# Altium schematic sheet sb-sonata-fpgapwr.SchDoc: <Enter Sheet Title>
size Letter; Organization: NewAE Technology Inc.; Address1: 1083 Queen St., Suite 196; Address2: Halifax; Address3: NS; Address4: Canada B3H 0B2; SheetNumber: 14; SheetTotal: 20; SheetApproved: YES
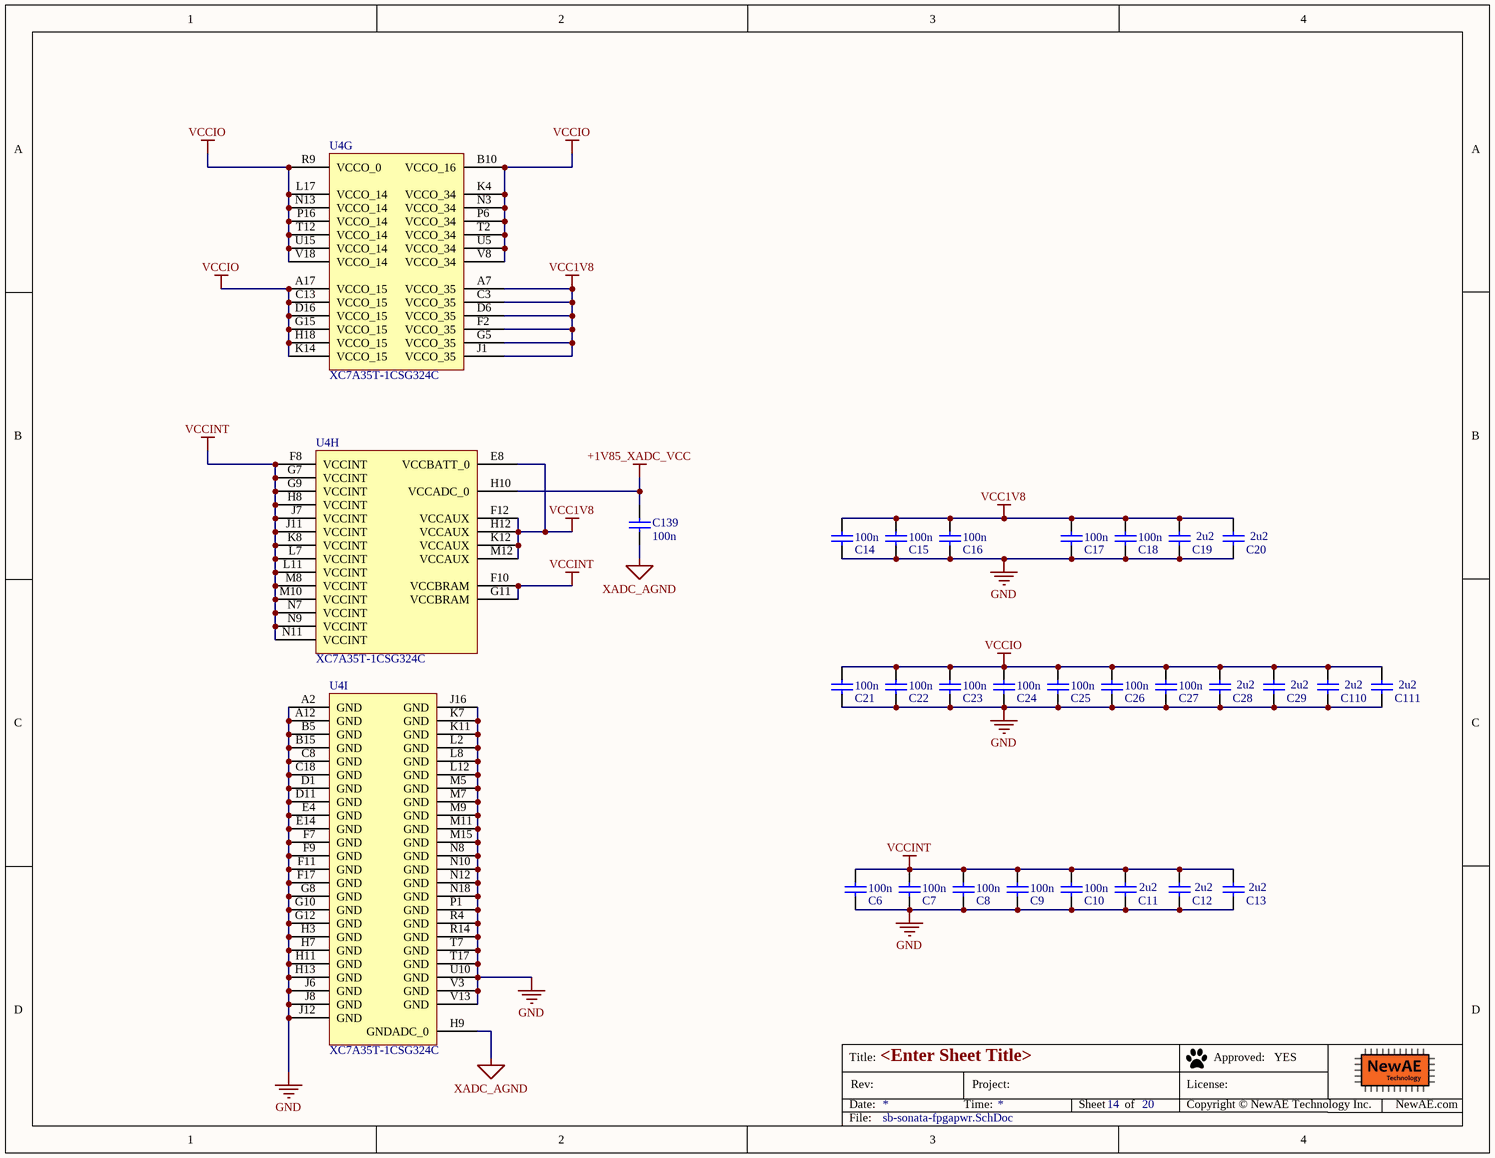
[diagram p0: sb-sonata-fpgapwr.SchDoc]

## Parts
C6  100n  [CAPC0402_M]
C7  100n  [CAPC0402_M]
C8  100n  [CAPC0402_M]
C9  100n  [CAPC0402_M]
C10  100n  [CAPC0402_M]
C11  2u2  [CAPC0603_M]
C12  2u2  [CAPC0603_M]
C13  2u2  [CAPC0603_M]
C14  100n  [CAPC0402_M]
C15  100n  [CAPC0402_M]
C16  100n  [CAPC0402_M]
C17  100n  [CAPC0402_M]
C18  100n  [CAPC0402_M]
C19  2u2  [CAPC0603_M]
C20  2u2  [CAPC0603_M]
C21  100n  [CAPC0402_M]
C22  100n  [CAPC0402_M]
C23  100n  [CAPC0402_M]
C24  100n  [CAPC0402_M]
C25  100n  [CAPC0402_M]
C26  100n  [CAPC0402_M]
C27  100n  [CAPC0402_M]
C28  2u2  [CAPC0603_M]
C29  2u2  [CAPC0603_M]
C110  2u2  [CAPC0603_M]
C111  2u2  [CAPC0603_M]
C139  100n  [CAPC0402_M]
U4  XC7A35T-1CSG324C  [CSG324]  (parts G,H,I of 9)

## Nets
+1V85_XADC_VCC: C139.1 U4.H10(VCCADC_0)
GND: C6.2 C7.2 C8.2 C9.2 C10.2 C11.2 C12.2 C13.2 C14.2 C15.2 C16.2 C17.2 C18.2 C19.2 C20.2 C21.2 C22.2 C23.2 C24.2 C25.2 C26.2 C27.2 C28.2 C29.2 C110.2 C111.2 U4.A2(GND) U4.A12(GND) U4.B5(GND) U4.B15(GND) U4.C8(GND) U4.C18(GND) U4.D1(GND) U4.D11(GND) U4.E4(GND) U4.E14(GND) U4.F7(GND) U4.F9(GND) U4.F11(GND) U4.F17(GND) U4.G8(GND) U4.G10(GND) U4.G12(GND) U4.H3(GND) U4.H7(GND) U4.H11(GND) U4.H13(GND) U4.J6(GND) U4.J8(GND) U4.J12(GND) U4.J16(GND) U4.K7(GND) U4.K11(GND) U4.L2(GND) U4.L8(GND) U4.L12(GND) U4.M5(GND) U4.M7(GND) U4.M9(GND) U4.M11(GND) U4.M15(GND) U4.N8(GND) U4.N10(GND) U4.N12(GND) U4.N18(GND) U4.P1(GND) U4.R4(GND) U4.R14(GND) U4.T7(GND) U4.T17(GND) U4.U10(GND) U4.V3(GND) U4.V13(GND)
VCC1V8: C14.1 C15.1 C16.1 C17.1 C18.1 C19.1 C20.1 U4.A7(VCCO_35) U4.C3(VCCO_35) U4.D6(VCCO_35) U4.E8(VCCBATT_0) U4.F2(VCCO_35) U4.F12(VCCAUX) U4.G5(VCCO_35) U4.H12(VCCAUX) U4.J1(VCCO_35) U4.K12(VCCAUX) U4.M12(VCCAUX)
VCCINT: C6.1 C7.1 C8.1 C9.1 C10.1 C11.1 C12.1 C13.1 U4.F8(VCCINT) U4.F10(VCCBRAM) U4.G7(VCCINT) U4.G9(VCCINT) U4.G11(VCCBRAM) U4.H8(VCCINT) U4.J7(VCCINT) U4.J11(VCCINT) U4.K8(VCCINT) U4.L7(VCCINT) U4.L11(VCCINT) U4.M8(VCCINT) U4.M10(VCCINT) U4.N7(VCCINT) U4.N9(VCCINT) U4.N11(VCCINT)
VCCIO: C21.1 C22.1 C23.1 C24.1 C25.1 C26.1 C27.1 C28.1 C29.1 C110.1 C111.1 U4.A17(VCCO_15) U4.B10(VCCO_16) U4.C13(VCCO_15) U4.D16(VCCO_15) U4.G15(VCCO_15) U4.H18(VCCO_15) U4.K4(VCCO_34) U4.K14(VCCO_15) U4.L17(VCCO_14) U4.N3(VCCO_34) U4.N13(VCCO_14) U4.P6(VCCO_34) U4.P16(VCCO_14) U4.R9(VCCO_0) U4.T2(VCCO_34) U4.T12(VCCO_14) U4.U5(VCCO_34) U4.U15(VCCO_14) U4.V8(VCCO_34) U4.V18(VCCO_14)
XADC_AGND: C139.2 U4.H9(GNDADC_0)

## Notes on the sheet
- Title:
- Date:
- Rev:
- Time:
- Project:
- Sheet
- of
- License:
- Copyright © NewAE Technology Inc.
- Approved:
- NewAE.com
- File:

## Library data of the parts
C6-C10 C14-C18 C21-C27 C139 = CCHIP-100n-0402: 100n, 0402; Manufacture Part Number 1: CGA2B3X7R1V104K050BB; Component Group: Capacitor; Case-EIA: 0402; Part Number: CCHIP-100n-0402; Footprint: 0402; Pin Count: 2; Value: 100n; Mounting Technology: SMT; Component Kind: Standard; Component Type: Standard; Supplier 1: Digi-Key; Supplier Part Number 1: 445-6901-1-ND
C11-C13 C19 C20 C28 C29 C110 C111 = CCHIP-2u2-0603: 2u2, 0603; Manufacture 1: Samsung; Manufacture Part Number 1: CL10B225KP8NNNC; Component Group: Capacitor; Case-EIA: 0603; Case-Metric: 1608; Rated Voltage: 10VDC; Part Number: CCHIP-2u2-0603; Footprint: 0603; Pin Count: 2; Supplier 1: Digi-Key; Supplier Part Number 1: 1276-1134-2-ND; Value: 2u2; Mounting Technology: SMT; Component Kind: Standard; Component Type: Standard
U4 = CMP-0383-00012-1: Artix-7 FPGA, 210 User I/Os, 0 GTP, 324-Ball BGA, Speed Grade 1, Commercial Grade, Pb-Free; Manufacturer: Xilinx; GTP: 0; Available User I/O: 210; Speed Grades: 1; Logic Cells: 33280; Total Block RAM: 1800 Kb; CMTs: 5; Maximum Distributed RAM: 400 Kb; ComponentLink2URL: http://www.xilinx.com/support/documentation/data_sheets/ds180_7Series_Overview.pdf; ComponentLink2Description: Datasheet; DatasheetVersion: Rev. 1.15; PackageDescription: 324-Ball Wire-Bond Chip-Scale BGA, Body 15 x 15 mm, Pitch 0.8 mm; ComponentLink4URL: http://www.xilinx.com/support/documentation/user_guides/ug475_7Series_Pkg_Pinout.pdf; PackageReference: CSG-324; Mounting Technology: Surface Mount; PackageVersion: Rev. 1.11; ComponentLink1Description: Manufacturer URL; ComponentLink3Description: Pinout; ComponentLink1URL: http://www.xilinx.com/; ComponentLink3URL: http://www.xilinx.com/support/documentation/user_guides/ug475_7Series_Pkg_Pinout.pdf; PartNumber: XC7A35T-1CSG324C; ComponentLink4Description: Package Specification; Operating Temperature Range: Commercial